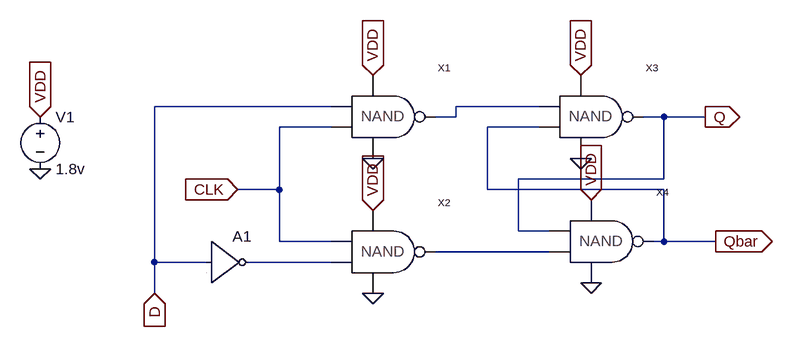
[diagram p0: schematic FF.asc]
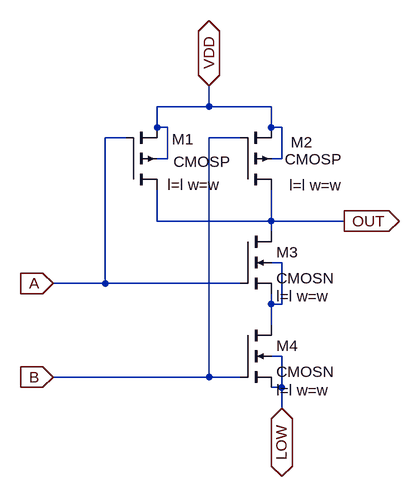
[diagram p1: sub-circuit nand.asc]
FF.asc, the LTspice schematic file:
Version 4
SHEET 1 880 680
WIRE 96 80 -176 80
WIRE 416 80 288 80
WIRE 288 96 288 80
WIRE 288 96 256 96
WIRE 608 96 576 96
WIRE 672 96 608 96
WIRE 96 112 16 112
WIRE 416 112 336 112
WIRE 608 192 608 96
WIRE 608 192 384 192
WIRE 16 208 16 112
WIRE 16 208 -48 208
WIRE 336 208 336 112
WIRE 608 208 336 208
WIRE 384 272 384 192
WIRE 432 272 384 272
WIRE 16 288 16 208
WIRE 96 288 16 288
WIRE 608 288 608 208
WIRE 608 288 592 288
WIRE 688 288 608 288
WIRE 432 304 256 304
WIRE -176 320 -176 80
WIRE -96 320 -176 320
WIRE 96 320 -32 320
WIRE -176 368 -176 320
FLAG 672 96 Q
IOPIN 672 96 Out
FLAG 688 288 Qbar
IOPIN 688 288 Out
FLAG 160 32 VDD
IOPIN 160 32 In
FLAG 480 32 VDD
IOPIN 480 32 In
FLAG 496 224 VDD
IOPIN 496 224 In
FLAG 160 240 VDD
IOPIN 160 240 In
FLAG 160 368 0
FLAG 496 352 0
FLAG 480 160 0
FLAG 160 160 0
FLAG -352 96 VDD
IOPIN -352 96 In
FLAG -352 176 0
FLAG -176 368 D
IOPIN -176 368 In
FLAG -48 208 CLK
IOPIN -48 208 In
SYMBOL NAND 176 192 R0
SYMATTR InstName X1
SYMBOL NAND 176 400 R0
SYMATTR InstName X2
SYMBOL NAND 496 192 R0
SYMATTR InstName X3
SYMBOL NAND 512 384 R0
SYMATTR InstName X4
SYMBOL Digital\\inv -96 256 R0
SYMATTR InstName A1
SYMBOL voltage -352 80 R0
WINDOW 123 0 0 Left 0
WINDOW 39 0 0 Left 0
SYMATTR InstName V1
SYMATTR Value 1.8v

nand.asc, the sub-circuit schematic file:
Version 4
SHEET 1 1024 680
WIRE 224 16 224 -16
WIRE 224 16 144 16
WIRE 320 16 224 16
WIRE 144 48 144 16
WIRE 160 48 144 48
WIRE 320 48 320 16
WIRE 336 48 320 48
WIRE 96 64 64 64
WIRE 272 64 224 64
WIRE 160 96 160 48
WIRE 160 96 144 96
WIRE 336 96 336 48
WIRE 336 96 320 96
WIRE 144 192 144 144
WIRE 320 192 320 144
WIRE 320 192 144 192
WIRE 432 192 320 192
WIRE 320 208 320 192
WIRE 336 256 320 256
WIRE 64 288 64 64
WIRE 64 288 -16 288
WIRE 272 288 64 288
WIRE 320 320 320 304
WIRE 336 320 336 256
WIRE 336 320 320 320
WIRE 320 352 320 320
WIRE 336 400 320 400
WIRE 224 432 224 64
WIRE 224 432 -16 432
WIRE 272 432 224 432
WIRE 336 448 336 400
WIRE 336 448 320 448
WIRE 336 480 336 448
FLAG 224 -16 VDD
IOPIN 224 -16 BiDir
FLAG 336 480 LOW
IOPIN 336 480 BiDir
FLAG 432 192 OUT
IOPIN 432 192 Out
FLAG -16 288 A
IOPIN -16 288 In
FLAG -16 432 B
IOPIN -16 432 In
SYMBOL nmos4 272 208 R0
WINDOW 123 56 100 Left 2
SYMATTR Value2 l=l w=w
SYMATTR InstName M3
SYMATTR Value CMOSN
SYMBOL nmos4 272 352 R0
WINDOW 123 56 100 Left 2
SYMATTR Value2 l=l w=w
SYMATTR InstName M4
SYMATTR Value CMOSN
SYMBOL pmos4 96 144 M180
WINDOW 123 64 8 Left 2
WINDOW 0 71 78 Left 2
WINDOW 3 73 43 Left 2
SYMATTR Value2 l=l w=w
SYMATTR InstName M1
SYMATTR Value CMOSP
SYMBOL pmos4 272 144 M180
WINDOW 123 76 7 Left 2
WINDOW 0 78 73 Left 2
WINDOW 3 69 47 Left 2
SYMATTR Value2 l=l w=w
SYMATTR InstName M2
SYMATTR Value CMOSP

The netlist it stands for:
* FF.asc
XX1 VDD 0 D CLK N001 nand
XX2 VDD 0 CLK N003 N002 nand
XX3 VDD 0 N001 Qbar Q nand
XX4 VDD 0 Q N002 Qbar nand
A1 D 0 0 0 0 N003 0 0 BUF
V1 VDD 0 1.8v

* block symbol definitions
.subckt nand VDD LOW A B OUT
M3 OUT A N001 N001 CMOSN l=l w=w
M4 N001 B LOW LOW CMOSN l=l w=w
M1 OUT A VDD VDD CMOSP l=l w=w
M2 OUT B VDD VDD CMOSP l=l w=w
.ends nand

.model NMOS NMOS
.model PMOS PMOS
.lib standard.mos
.backanno
.end